# Altium project 理五企业合作.PRJPCB
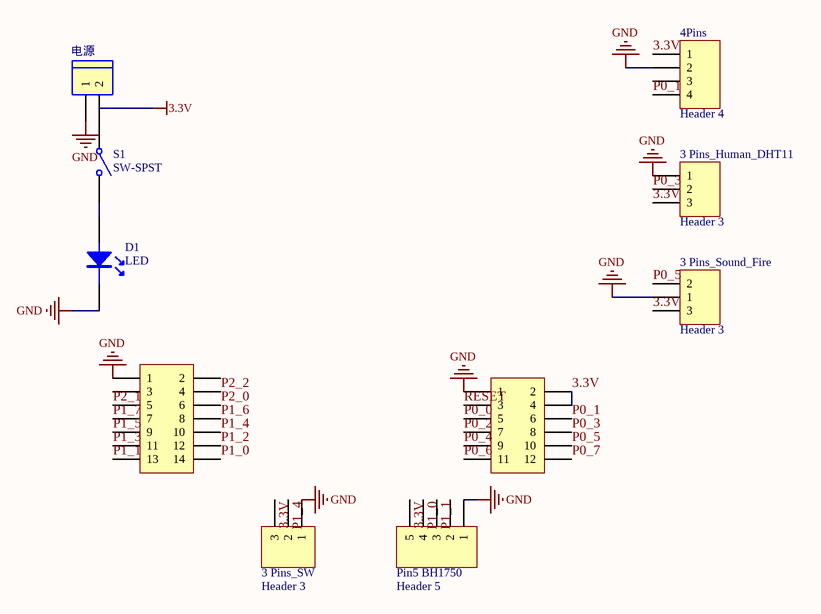
[diagram p0: 理五企业合作.SchDoc]
1 sheet, 10 parts. Net scope: global (net labels, ports and power ports of the same name join across sheets).
Board file: 理五企业合作.PcbDoc

## Sheet 理五企业合作.SchDoc
size A

### Parts
3_Pins_Human_DHT11  Header 3  [HDR1X3]
3_Pins_Sound_Fire  Header 3  [HDR1X3]
3_Pins_SW  Header 3  [HDR1X3]
4Pins  Header 4  [HDR1X4]
D1  LED  [1608[0603]]
JP2  Header 2X7  [HDR2X7]  (value not drawn)
JP3  Header 2X6  [HDR2X6]  (value not drawn)
Pin5_BH1750  Header 5  [HDR1X5]
S1  SW-SPST  [HDR2X2]
电源  (no value)  [HDR1X2]

### Nets
3.3V: 3_Pins_Human_DHT11.3 3_Pins_Sound_Fire.3 3_Pins_SW.3 4Pins.1 JP3.2 JP3.4 Pin5_BH1750.5
GND: 3_Pins_Human_DHT11.1 3_Pins_Sound_Fire.1 3_Pins_SW.1 4Pins.2 D1.K JP2.1 JP3.1 Pin5_BH1750.1 电源.1
P0_0: JP3.5
P0_1: 4Pins.4 JP3.6
P0_2: JP3.7
P0_3: 3_Pins_Human_DHT11.2 JP3.8
P0_4: JP3.9
P0_5: 3_Pins_Sound_Fire.2 JP3.10
P0_6: JP3.11
P0_7: JP3.12
P1_0: JP2.14 Pin5_BH1750.4
P1_1: JP2.13 Pin5_BH1750.3
P1_2: JP2.12
P1_3: JP2.11
P1_4: 3_Pins_SW.2 JP2.10
P1_5: JP2.9
P1_6: JP2.8
P1_7: JP2.7
P2_0: JP2.6
P2_1: JP2.5
P2_2: JP2.4
RESET: JP3.3
NetD1_A: D1.A S1.2(NO)
NetS1_1: S1.1(COMMON) 电源.2

Not connected (* = marked no-connect by the designer): 4Pins 3; JP2 2 3; Pin5_BH1750 2

### Library data of the parts
3_Pins_Human_DHT11 3_Pins_Sound_Fire 3_Pins_SW = Header 3: Header, 3-Pin; LatestRevisionDate: 17-Jul-2002; LatestRevisionNote: Re-released for DXP Platform.; Publisher: Altium Limited
4Pins = Header 4: Header, 4-Pin; LatestRevisionDate: 17-Jul-2002; LatestRevisionNote: Re-released for DXP Platform.; Publisher: Altium Limited
JP2 = Header 2X7: Header, 7-Pin, Dual row; Manufacturer: Generic Components; Class: Connector
JP3 = Header 2X6: Header, 6-Pin, Dual row; Manufacturer: Generic Components; Class: Connector
Pin5_BH1750 = Header 5: Header, 5-Pin; LatestRevisionDate: 17-Jul-2002; LatestRevisionNote: Re-released for DXP Platform.; Publisher: Altium Limited
S1 = SW-SPST: Single-Pole, Single-Throw Switch; Manufacturer: Generic Components; Published: 1999
电源 = H-2: Header, 2-Pin; Manufacturer: Generic Components; Class: Connector